# EAGLE schematic lite-board (EAGLE 6.6.0)
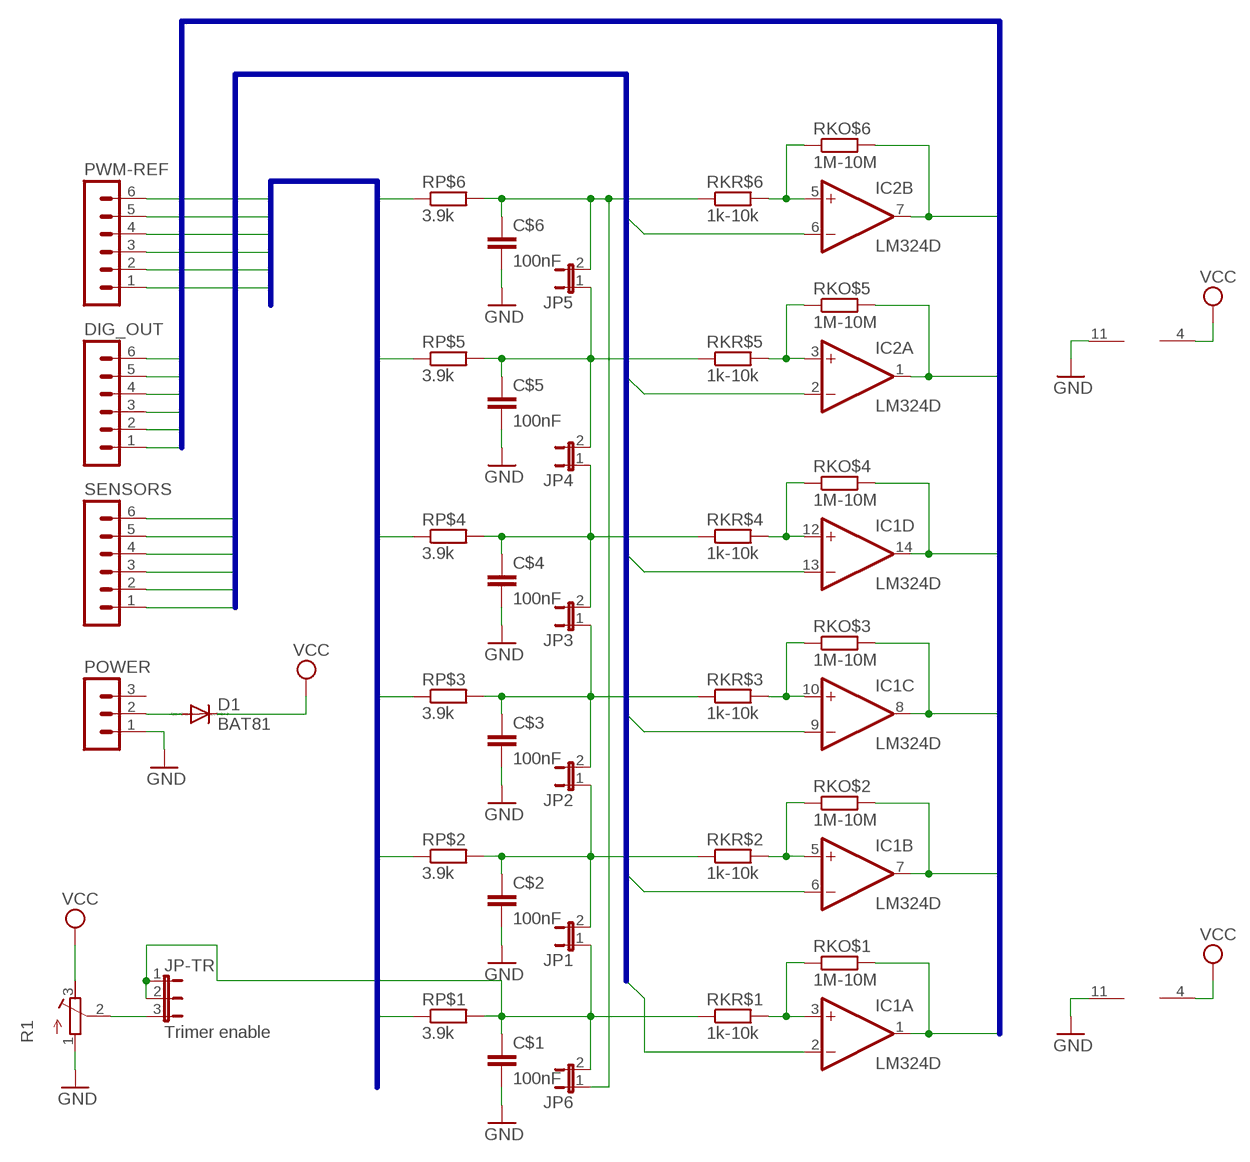
[diagram p0: schematic, sheet 1]

## Parts
C$1  100nF  C-EU025-030X050  [C025-030X050]
C$2  100nF  C-EU025-030X050  [C025-030X050]
C$3  100nF  C-EU025-030X050  [C025-030X050]
C$4  100nF  C-EU025-030X050  [C025-030X050]
C$5  100nF  C-EU025-030X050  [C025-030X050]
C$6  100nF  C-EU025-030X050  [C025-030X050]
D1  BAT81  [DO34-7]
DIG_OUT  MA06-1  [MA06-1]
IC1  LM324D  [SO14]
IC2  LM324D  [SO14]
JP1  JP1E  [JP1]
JP2  JP1E  [JP1]
JP3  JP1E  [JP1]
JP4  JP1E  [JP1]
JP5  JP1E  [JP1]
JP6  JP1E  [JP1]
JP-TR  Trimer enable  JP2E  [JP2]
POWER  MA03-1  [MA03-1]
PWM-REF  MA06-1  [MA06-1]
R1  R-TRIMM3296Y  [RTRIM3296Y]
RKO$1  1M-10M  R-EU_0204/7  [0204/7]
RKO$2  1M-10M  R-EU_0204/7  [0204/7]
RKO$3  1M-10M  R-EU_0204/7  [0204/7]
RKO$4  1M-10M  R-EU_0204/7  [0204/7]
RKO$5  1M-10M  R-EU_0204/7  [0204/7]
RKO$6  1M-10M  R-EU_0204/7  [0204/7]
RKR$1  1k-10k  R-EU_0204/7  [0204/7]
RKR$2  1k-10k  R-EU_0204/7  [0204/7]
RKR$3  1k-10k  R-EU_0204/7  [0204/7]
RKR$4  1k-10k  R-EU_0204/7  [0204/7]
RKR$5  1k-10k  R-EU_0204/7  [0204/7]
RKR$6  1k-10k  R-EU_0204/7  [0204/7]
RP$1  3.9k  R-EU_0204/7  [0204/7]
RP$2  3.9k  R-EU_0204/7  [0204/7]
RP$3  3.9k  R-EU_0204/7  [0204/7]
RP$4  3.9k  R-EU_0204/7  [0204/7]
RP$5  3.9k  R-EU_0204/7  [0204/7]
RP$6  3.9k  R-EU_0204/7  [0204/7]
SENSORS  MA06-1  [MA06-1]

## Nets
BOUT1: DIG_OUT.1 IC1.1(A:OUT) RKO$1.2
BOUT2: DIG_OUT.2 IC1.7(B:OUT) RKO$2.2
BOUT3: DIG_OUT.3 IC1.8(C:OUT) RKO$3.2
BOUT4: DIG_OUT.4 IC1.14(D:OUT) RKO$4.2
BOUT5: DIG_OUT.5 IC2.1(A:OUT) RKO$5.2
BOUT6: DIG_OUT.6 IC2.7(B:OUT) RKO$6.2
BSENZ1: IC1.2(A:-IN) SENSORS.1
BSENZ2: IC1.6(B:-IN) SENSORS.2
BSENZ3: IC1.9(C:-IN) SENSORS.3
BSENZ4: IC1.13(D:-IN) SENSORS.4
BSENZ5: IC2.2(A:-IN) SENSORS.5
BSENZ6: IC2.6(B:-IN) SENSORS.6
GND: C$1.2 C$2.2 C$3.2 C$4.2 C$5.2 C$6.2 IC1.11(P:V-) IC2.11(P:V-) POWER.1 R1.1(E)
N$1: IC1.3(A:+IN) RKO$1.1 RKR$1.2
N$2: C$1.1 JP1.1 JP6.2 JP-TR.1 JP-TR.2 RKR$1.1 RP$1.2
N$3: IC2.5(B:+IN) RKO$6.1 RKR$6.2
N$4: IC1.5(B:+IN) RKO$2.1 RKR$2.2
N$5: D1.A POWER.2
N$6: C$2.1 JP1.2 JP2.1 RKR$2.1 RP$2.2
N$7: IC1.10(C:+IN) RKO$3.1 RKR$3.2
N$9: C$3.1 JP2.2 JP3.1 RKR$3.1 RP$3.2
N$10: IC1.12(D:+IN) RKO$4.1 RKR$4.2
N$12: C$4.1 JP3.2 JP4.1 RKR$4.1 RP$4.2
N$13: IC2.3(A:+IN) RKO$5.1 RKR$5.2
N$15: C$5.1 JP4.2 JP5.1 RKR$5.1 RP$5.2
N$18: C$6.1 JP5.2 JP6.1 RKR$6.1 RP$6.2
N$19: JP-TR.3 R1.2(S)
REF1: PWM-REF.1 RP$1.1
REF2: PWM-REF.2 RP$2.1
REF3: PWM-REF.3 RP$3.1
REF4: PWM-REF.4 RP$4.1
REF5: PWM-REF.5 RP$5.1
REF6: PWM-REF.6 RP$6.1
VCC: D1.C IC1.4(P:V+) IC2.4(P:V+) R1.3(A)
Unconnected: IC2.8(C:OUT) IC2.9(C:-IN) IC2.10(C:+IN) IC2.12(D:+IN) IC2.13(D:-IN) IC2.14(D:OUT) POWER.3

## Buses
REF[1..6]
BOUT[1..6]
BSENZ[1..6]

## Library data of the parts
C$1-C$6 = rcl:C-EU: CAPACITOR, European symbol
D1 = diode:BAT81: DIODE barrier diode
DIG_OUT PWM-REF SENSORS = con-lstb:MA06-1: PIN HEADER; OC_FARNELL: unknown; OC_NEWARK: unknown
IC1 IC2 = linear:LM324: OP AMP
JP1-JP6 = jumper:JP1E: JUMPER
JP-TR = jumper:JP2E: JUMPER
POWER = con-lstb:MA03-1: PIN HEADER; OC_FARNELL: unknown; OC_NEWARK: unknown
R1 = resistor:R-TRIMM: Trimm resistor
RKO$1-RKO$6 RKR$1-RKR$6 = resistor:R-EU_: RESISTOR, European symbol
RP$1-RP$6 = rcl:R-EU_: RESISTOR, European symbol